# Altium schematic sheet TOP.SchDoc: =DocumentName
size A4; Organization: Queen's Formula SAE; Address1: 130 Stuart St, Kingston; Address2: Ontario; Address3: Canada; Address4: K7L 2V9; DocumentNumber: 1; Revision: 0; SheetNumber: 1; SheetTotal: 1
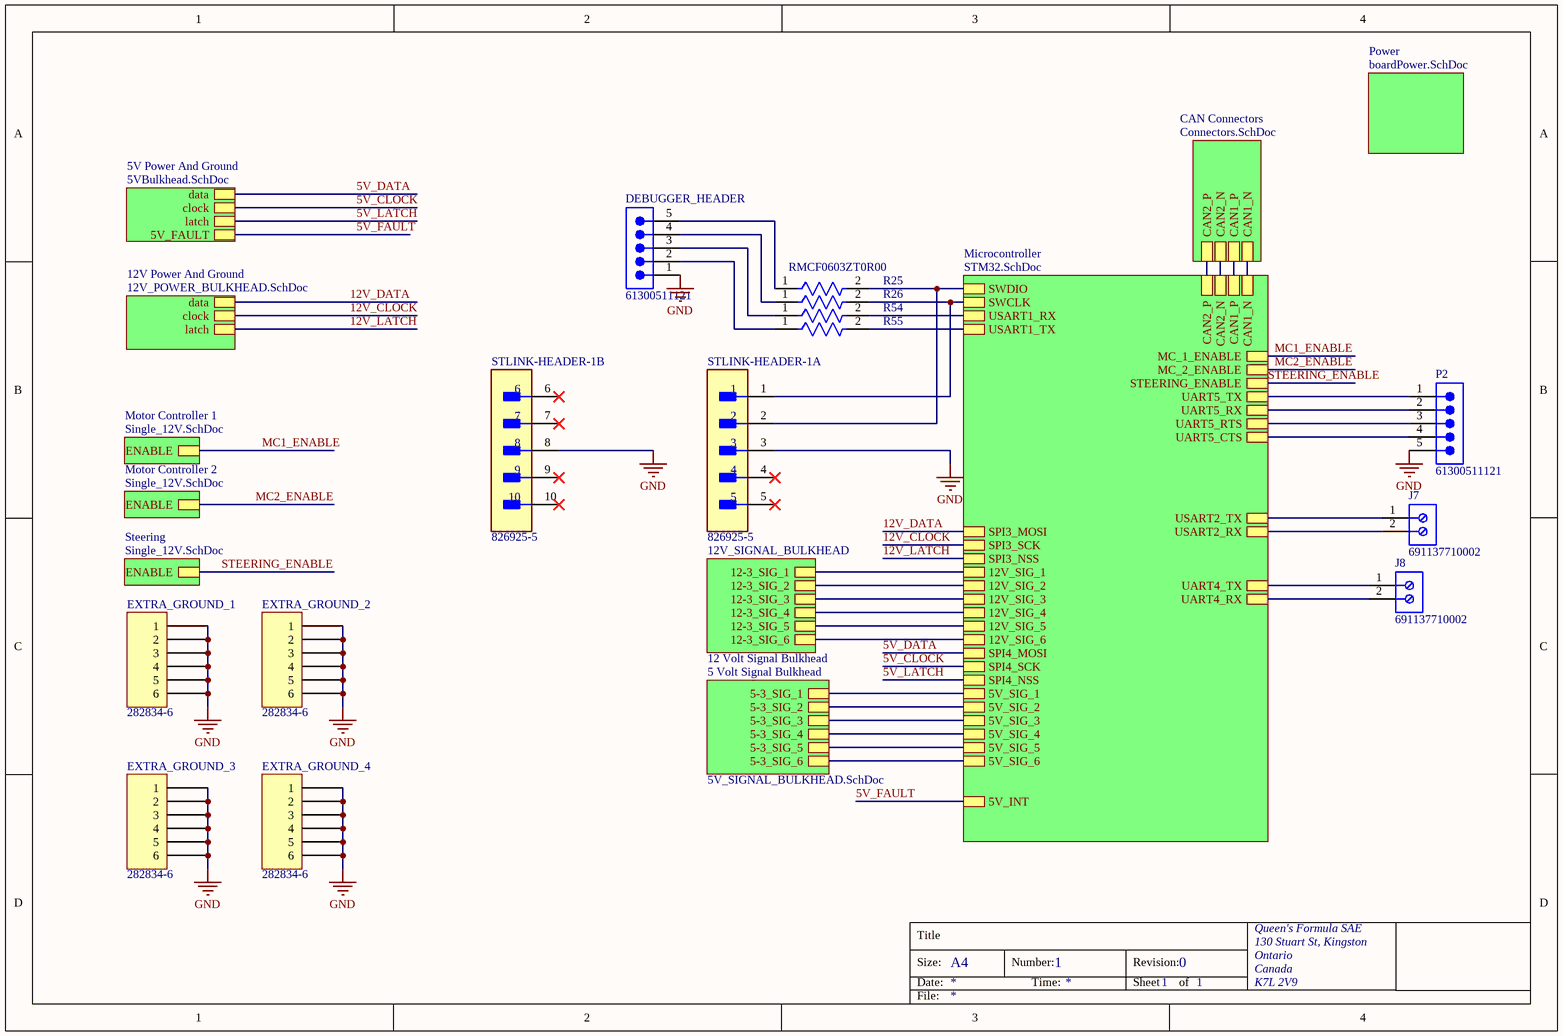
[diagram p0: TOP.SchDoc]

## Parts
DEBUGGER_HEADER  61300511121  [61300511121]
EXTRA_GROUND_1  282834-6  [TE 282834-6]
EXTRA_GROUND_2  282834-6  [TE 282834-6]
EXTRA_GROUND_3  282834-6  [TE 282834-6]
EXTRA_GROUND_4  282834-6  [TE 282834-6]
J7  691137710002  [691137710002]
J8  691137710002  [691137710002]
P2  61300511121  [61300511121]
R25  RMCF0603ZT0R00  [FP-RMCF0603-MFG]
R26  RMCF0603ZT0R00  [FP-RMCF0603-MFG]  (value not drawn)
R54  RMCF0603ZT0R00  [FP-RMCF0603-MFG]  (value not drawn)
R55  RMCF0603ZT0R00  [FP-RMCF0603-MFG]  (value not drawn)
STLINK-HEADER-1  826925-5  [FP-826925-5-MFG]  (parts A,B of 2)

## Sub-sheets
5 Volt Signal Bulkhead = 5V_SIGNAL_BULKHEAD.SchDoc: 5-3_SIG_1, 5-3_SIG_2, 5-3_SIG_3, 5-3_SIG_4, 5-3_SIG_5, 5-3_SIG_6
5V Power And Ground = 5VBulkhead.SchDoc: data, clock, latch, 5V_FAULT
12 Volt Signal Bulkhead = 12V_SIGNAL_BULKHEAD: 12-3_SIG_1, 12-3_SIG_2, 12-3_SIG_3, 12-3_SIG_4, 12-3_SIG_5, 12-3_SIG_6
12V Power And Ground = 12V_POWER_BULKHEAD.SchDoc: data, clock, latch
CAN Connectors = Connectors.SchDoc: CAN1_N, CAN1_P, CAN2_N, CAN2_P
Microcontroller = STM32.SchDoc: SWDIO, SWCLK, USART1_RX, USART1_TX, SPI3_NSS, SPI3_MOSI, SPI3_SCK, CAN1_P, CAN1_N, CAN2_N, CAN2_P, 12V_SIG_1, MC_1_ENABLE, MC_2_ENABLE, STEERING_ENABLE, 12V_SIG_2, 12V_SIG_4, 12V_SIG_3, 12V_SIG_5, 12V_SIG_6, SPI4_NSS, SPI4_MOSI, SPI4_SCK, 5V_SIG_1, 5V_SIG_2, 5V_SIG_3, 5V_SIG_5, 5V_SIG_4, 5V_SIG_6, UART5_TX, UART5_RX, UART5_RTS, UART5_CTS, 5V_INT, USART2_TX, USART2_RX, UART4_TX, UART4_RX
Motor Controller 1 = Single_12V.SchDoc: ENABLE
Motor Controller 2 = Single_12V.SchDoc: ENABLE
Power = boardPower.SchDoc: no entries
Steering = Single_12V.SchDoc: ENABLE

## Nets
GND: DEBUGGER_HEADER.1 EXTRA_GROUND_1.1 EXTRA_GROUND_1.2 EXTRA_GROUND_1.3 EXTRA_GROUND_1.4 EXTRA_GROUND_1.5 EXTRA_GROUND_1.6 EXTRA_GROUND_2.1 EXTRA_GROUND_2.2 EXTRA_GROUND_2.3 EXTRA_GROUND_2.4 EXTRA_GROUND_2.5 EXTRA_GROUND_2.6 EXTRA_GROUND_3.1 EXTRA_GROUND_3.2 EXTRA_GROUND_3.3 EXTRA_GROUND_3.4 EXTRA_GROUND_3.5 EXTRA_GROUND_3.6 EXTRA_GROUND_4.1 EXTRA_GROUND_4.2 EXTRA_GROUND_4.3 EXTRA_GROUND_4.4 EXTRA_GROUND_4.5 EXTRA_GROUND_4.6 P2.5 STLINK-HEADER-1.3 STLINK-HEADER-1.8
5V_CLOCK: sheet Microcontroller/SPI4_SCK, sheet 5V Power And Ground/clock
5V_DATA: sheet Microcontroller/SPI4_MOSI, sheet 5V Power And Ground/data
5V_FAULT: sheet Microcontroller/5V_INT, sheet 5V Power And Ground/5V_FAULT
5V_LATCH: sheet Microcontroller/SPI4_NSS, sheet 5V Power And Ground/latch
12V_CLOCK: sheet Microcontroller/SPI3_SCK, sheet 12V Power And Ground/clock
12V_DATA: sheet Microcontroller/SPI3_MOSI, sheet 12V Power And Ground/data
12V_LATCH: sheet Microcontroller/SPI3_NSS, sheet 12V Power And Ground/latch
MC1_ENABLE: sheet Microcontroller/MC_1_ENABLE, sheet Motor Controller 1/ENABLE
MC2_ENABLE: sheet Microcontroller/MC_2_ENABLE, sheet Motor Controller 2/ENABLE
STEERING_ENABLE: sheet Microcontroller/STEERING_ENABLE, sheet Steering/ENABLE
NetDEBUGGER_HEADER_2: DEBUGGER_HEADER.2 R55.1
NetDEBUGGER_HEADER_3: DEBUGGER_HEADER.3 R54.1
NetDEBUGGER_HEADER_4: DEBUGGER_HEADER.4 R26.1
NetDEBUGGER_HEADER_5: DEBUGGER_HEADER.5 R25.1
NetJ7_1: J7.1 ; sheet Microcontroller/USART2_TX
NetJ7_2: J7.2 ; sheet Microcontroller/USART2_RX
NetJ8_1: J8.1 ; sheet Microcontroller/UART4_TX
NetJ8_2: J8.2 ; sheet Microcontroller/UART4_RX
NetP2_1: P2.1 ; sheet Microcontroller/UART5_TX
NetP2_2: P2.2 ; sheet Microcontroller/UART5_RX
NetP2_3: P2.3 ; sheet Microcontroller/UART5_RTS
NetP2_4: P2.4 ; sheet Microcontroller/UART5_CTS
NetR25_2: R25.2 STLINK-HEADER-1.2 ; sheet Microcontroller/SWDIO
NetR26_2: R26.2 STLINK-HEADER-1.1 ; sheet Microcontroller/SWCLK
NetR54_2: R54.2 ; sheet Microcontroller/USART1_RX
NetR55_2: R55.2 ; sheet Microcontroller/USART1_TX
(unnamed): sheet Microcontroller/CAN1_P, sheet CAN Connectors/CAN1_P
(unnamed): sheet Microcontroller/CAN1_N, sheet CAN Connectors/CAN1_N
(unnamed): sheet Microcontroller/CAN2_N, sheet CAN Connectors/CAN2_N
(unnamed): sheet Microcontroller/CAN2_P, sheet CAN Connectors/CAN2_P
(unnamed): sheet Microcontroller/12V_SIG_1, sheet 12 Volt Signal Bulkhead/12-3_SIG_1
(unnamed): sheet Microcontroller/12V_SIG_2, sheet 12 Volt Signal Bulkhead/12-3_SIG_2
(unnamed): sheet Microcontroller/12V_SIG_4, sheet 12 Volt Signal Bulkhead/12-3_SIG_4
(unnamed): sheet Microcontroller/12V_SIG_3, sheet 12 Volt Signal Bulkhead/12-3_SIG_3
(unnamed): sheet Microcontroller/12V_SIG_5, sheet 12 Volt Signal Bulkhead/12-3_SIG_5
(unnamed): sheet Microcontroller/12V_SIG_6, sheet 12 Volt Signal Bulkhead/12-3_SIG_6
(unnamed): sheet Microcontroller/5V_SIG_1, sheet 5 Volt Signal Bulkhead/5-3_SIG_1
(unnamed): sheet Microcontroller/5V_SIG_2, sheet 5 Volt Signal Bulkhead/5-3_SIG_2
(unnamed): sheet Microcontroller/5V_SIG_3, sheet 5 Volt Signal Bulkhead/5-3_SIG_3
(unnamed): sheet Microcontroller/5V_SIG_5, sheet 5 Volt Signal Bulkhead/5-3_SIG_5
(unnamed): sheet Microcontroller/5V_SIG_4, sheet 5 Volt Signal Bulkhead/5-3_SIG_4
(unnamed): sheet Microcontroller/5V_SIG_6, sheet 5 Volt Signal Bulkhead/5-3_SIG_6

Not connected (* = marked no-connect by the designer): STLINK-HEADER-1 4* 5* 6* 7* 9* 10*

## Notes on the sheet
- Title
- Size:
- Date:
- A4
- Number:
- Time:
- Revision:
- Sheet
- of
- File:

## Library data of the parts
DEBUGGER_HEADER P2 = CMP-1502-01068-2: NexarPartId: 32855526; Operating Supply Voltage: 250V; Number of Contacts: 5; Connector Type: Male Pin; Current Rating: 3A; Contact Resistance: 20mΩ; Pitch: 2.54mm; Gender: Male; Termination: Solder; RoHS: Compliant; Lead Pitch: 2.54mm; Contact Mating Length: 5.9944mm; Number of Positions: 5; Lead Free: Lead Free; Contact Plating: Gold; Number of Pins: 5; Min Operating Temperature: -40°C; Voltage Rating: 250V; Color: Black; Mount: Through Hole; REACH SVHC: Unknown; Packaging: Bulk; Height: 8.89mm; Number of Rows: 1; Orientation: Vertical; Contact Material: Copper; Max Operating Temperature: 105°C
EXTRA_GROUND_1-EXTRA_GROUND_4 = 282834-6: TERM BLK 6P SIDE ENT 2.54MM PCB; Manufacturer: TE Connectivity AMP Connectors; Current: 10A; Mating Orientation: Horizontal with Board; Number of Levels: 1; Pitch: 0.100" (2.54mm); Positions Per Level: 6; Voltage: 150V; Wire Gauge: 16-30 AWG; Wire Termination: Screw - Rising Cage Clamp; Part Number: 282834-6; Color: Green; ComponentLink1Description: Datasheet; ComponentLink1URL: https://www.te.com/commerce/DocumentDelivery/DDEController?Action=srchrtrv&DocNm=282834&DocType=Customer+Drawing&DocLang=English; ComponentLink2Description: DigiKey Link; ComponentLink2URL: http://digikey.com/product-detail/en/te-connectivity-amp-connectors/282834-6/A98337-ND/1153267; LastUpdated: 2020-01-15 4:16:31 AM; Lifecycle Status: Active; Minimum Order: 1; Mounting Type: Through Hole; Packaging: Bulk; Part Status: Active; Price: 4.72; Series: Buchanan; Supplier 1: DigiKey; Supplier Part Number 1: A98337-ND
J7 J8 = CMP-1502-03324-2: NexarPartId: 78871135; Voltage Rating: 300V; Number of Contacts: 2; Current Rating: 16A; Lead Pitch: 5mm; Height: 11.6mm; Packaging: Box; RoHS: Non-Compliant; Contact Material: Nickel, Tin; Max Operating Temperature: 120°C; Number of Pins: 2; Min Operating Temperature: -30°C; Number of Rows: 1
R25 R26 R54 R55 = CMP-26527-000011-1: RES 0 OHM JUMPER 1/10W 0603; Manufacturer: Stackpole; Power Rating: 0.1W; Voltage Rating: 75V; Resistance: 0mΩ; Automotive Grade: Grade 0; Value: 0mΩ; Series: RMCF; Manufacturer Part Number: RMCF0603ZT0R00; Device Class L1: Passive Components; Device Class L3: Chip SMD Resistors; Octopart: https://octopart.com/rmcf0603zt0r00-stackpole+electronics-19213618; Temperature: -55°C to +155°C; Lead Free: Yes; ComponentLink2URL: https://www.seielect.com/catalog/sei-rmcf_rmcp.pdf; Height: 0.55mm; Composition: Thick Film; Package: RMCF0603; Automotive: Yes; Temperature Range High: +155°C; Ipc Land Pattern Name: RESC15580X45; Digikey Description: RES 0 OHM JUMPER 1/10W 0603; RoHS: TRUE; ComponentLink2Description: Datasheet; Temperature Range Low: -55°C; Category: Res; Device Class L2: Resistors
STLINK-HEADER-1 = CMP-03369-000006-1: CONN HEADER VERT 10POS 2.54MM; Manufacturer: TE Connectivity; Conn Orientation: Vertical; Standoff Height: 0.3mm; Number Of Contacts: 10; Current Rating: 5A; Conn Gender: Male; Number Of Rows: 2; Category: Conn; Octopart: https://octopart.com/826925-5-te+connectivity-41836231; Lead Free: Yes; Height: 9.9mm; ComponentLink2Description: Datasheet; Temperature Range High: +105°C; Pitch: 2.54mm; Manufacturer Part Number: 826925-5; Automotive: No; Digikey Description: CONN HEADER VERT 10POS 2.54MM; ComponentLink2URL: https://www.te.com/commerce/DocumentDelivery/DDEController?Action=showdoc&DocId=Customer+Drawing%7F826629%7FAC%7Fpdf%7FEnglish%7FENG_CD_826629_AC.pdf%7F826925-5; Temperature: -65°C to +105°C; RoHS: TRUE; Package: 826925-5; Contact Material: Tin,Nickel; Mouser Description: Headers & Wire Housings 2X05 POS VERT TIN; Device Class L2: Headers and Wire Housings; Device Class L3: unset; Device Class L1: Connectors; Temperature Range Low: -65°C